# EasyEDA Pro project Cerberus_Power_V02.eprj, board PCB1
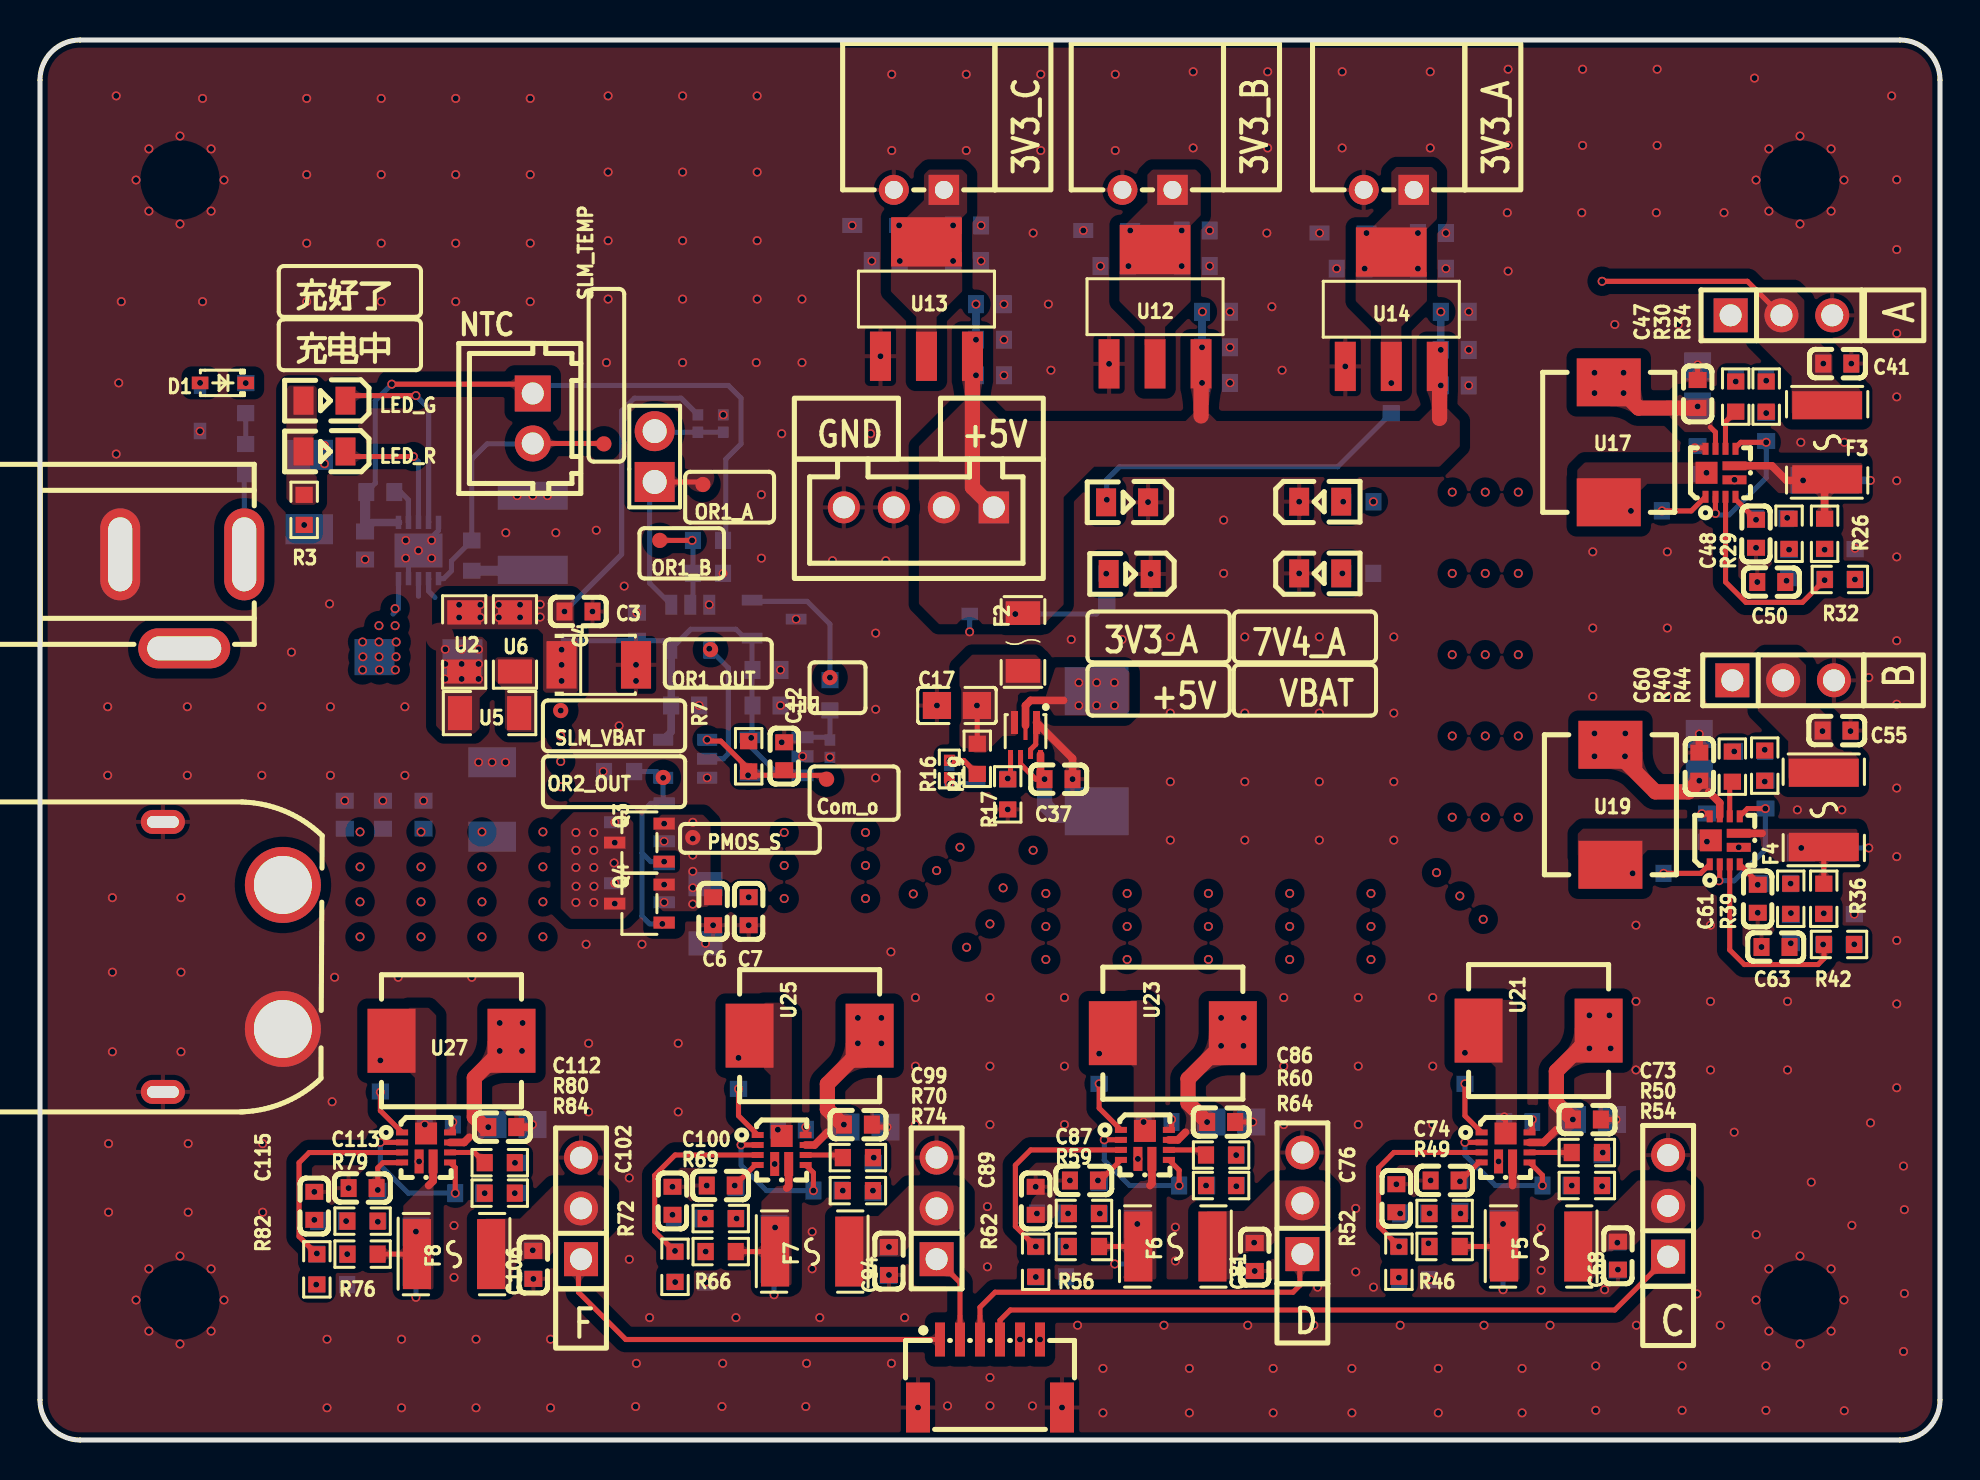
[diagram p2: board, top side]
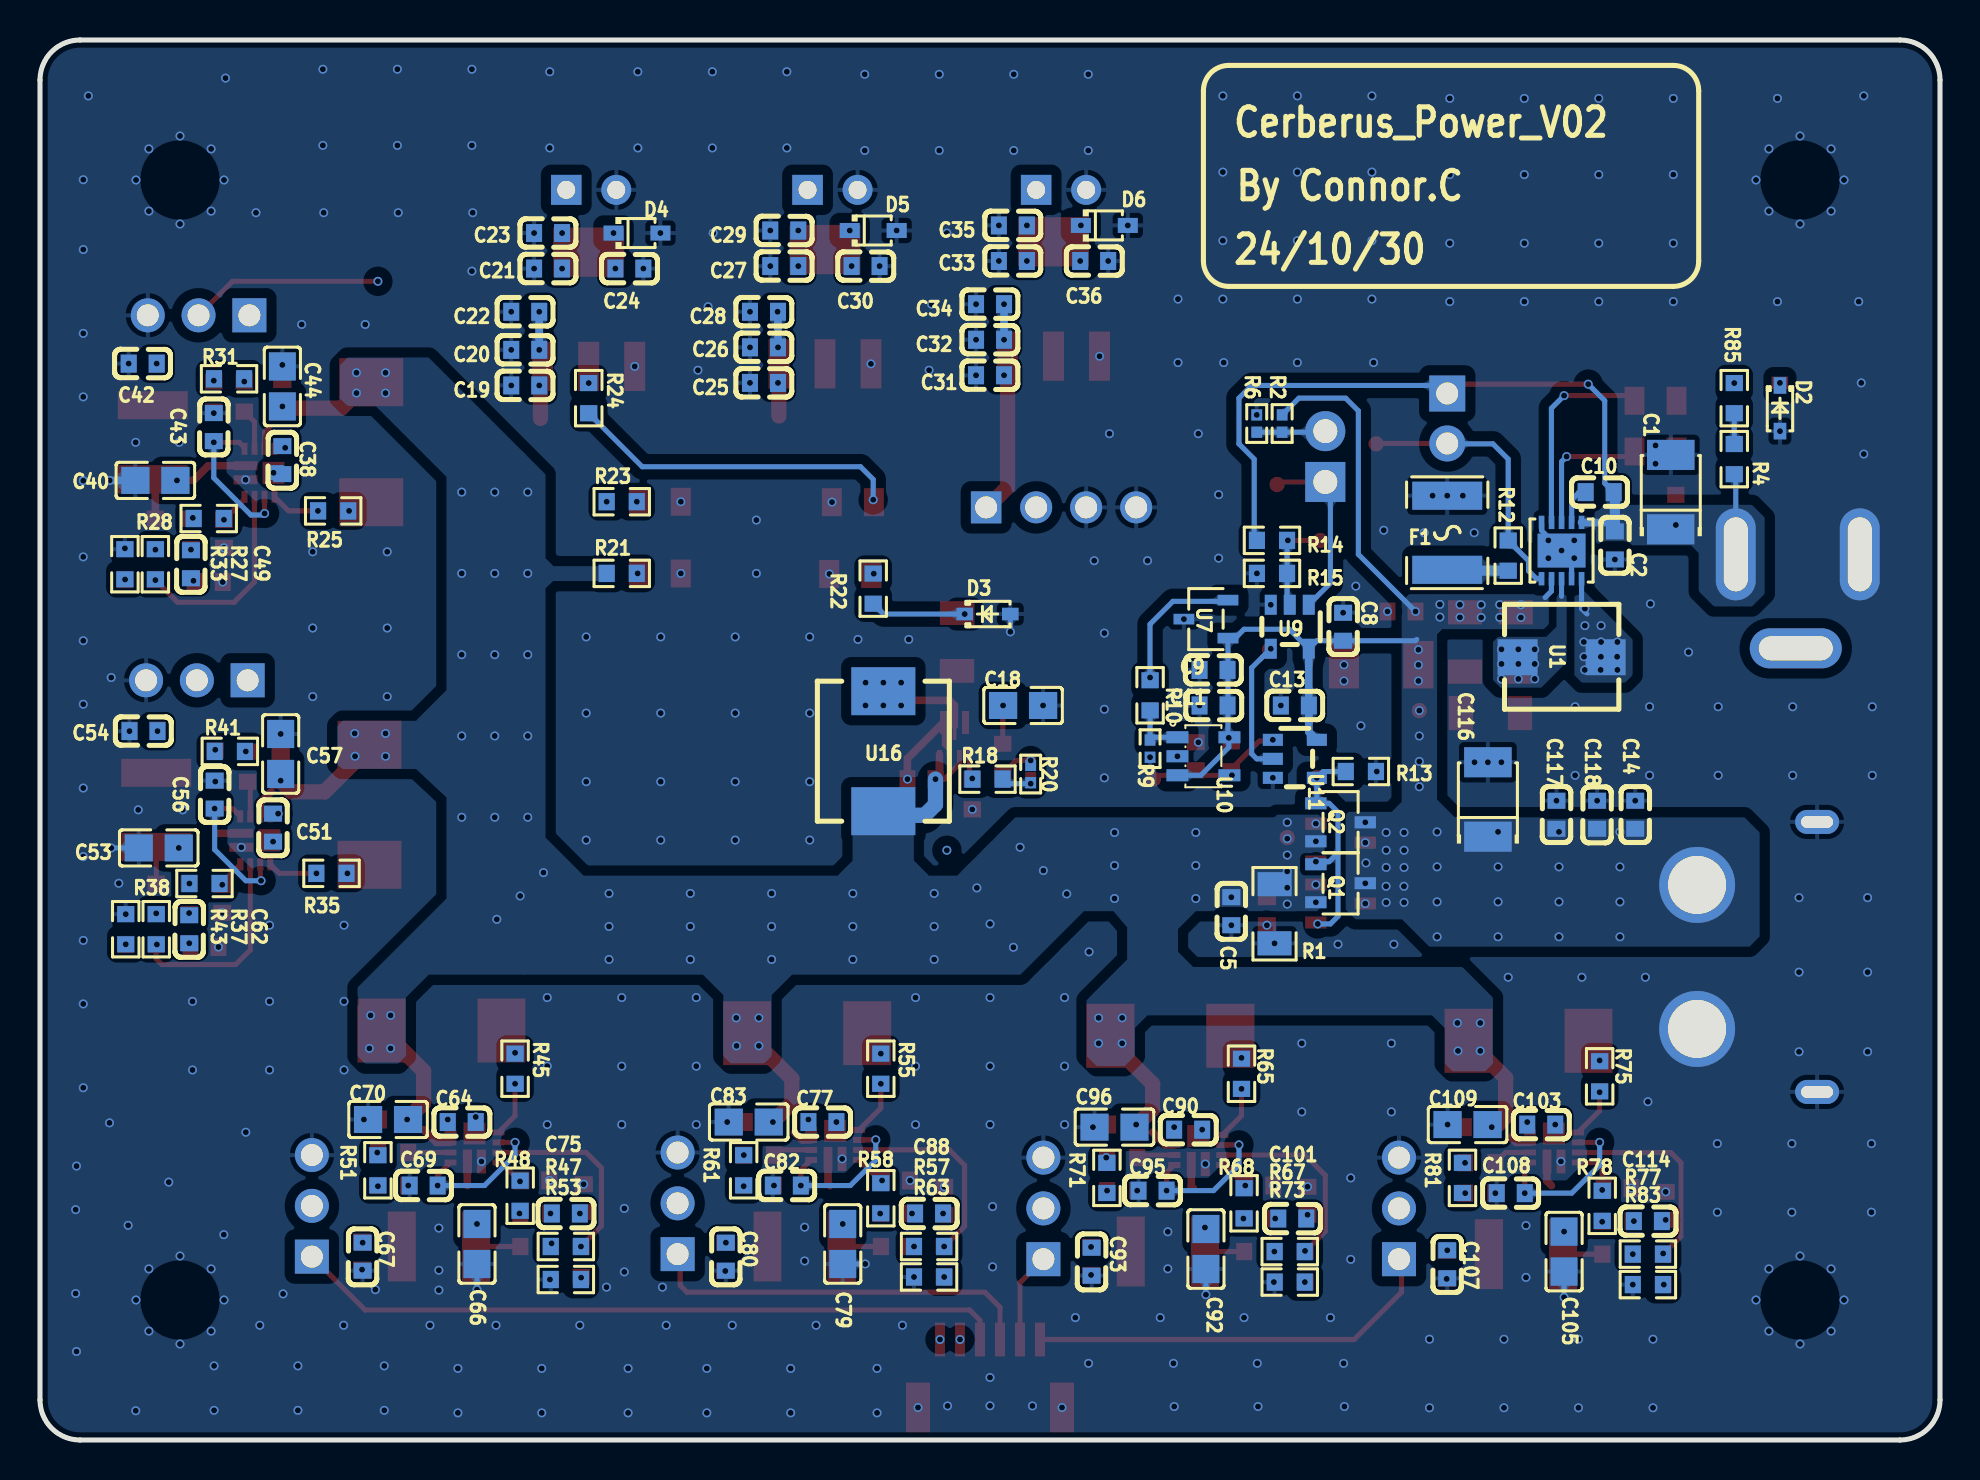
[diagram p3: board, bottom side, seen from below]

Outline 95 x 70 mm; copper layers: Top Layer, GND, 电源加厚, Bottom Layer. Coordinates in mm from the lower left corner of the outline.
Outline path: 0,68 0,2 arc(0.59,0.59) 2,0 93,0 arc(94.41,0.59) 95,2 95,68 arc(94.41,69.41) 93,70 2,70 arc(0.59,69.41) 0,68
Stack: Top Layer 0.035mm 外层铜厚1oz / Dielectric1 0.2104mm 7628 RC49% 8.6mil / GND 0.0152mm 内层铜厚 / Dielectric2 1.065mm 1.1mm H/HOZ Copper / 电源加厚 0.0152mm 内层铜厚 / Dielectric3 0.2104mm 7628 RC49% 8.6mil / Bottom Layer 0.035mm 外层铜厚1oz

## Design rules (mm)
template: 自定义配置
spacing copperThickness1oz (default): track to track 0.102, other pairs 0.152 to 0.3
spacing copperThickness2oz: track to track 0.203, other pairs 0.152 to 0.3
track width copperThickness1oz (default): min 0.127, default 0.254, max 10
track width copperThickness2oz: min 0.203, default 0.254, max 2.54
differential pair differentialPair (default): width min 0.127, default 0.254, max 2.54; gap min 0.152, default 0.152
via viaSize (default): diameter min 0.45, default 0.45, max 0.45; hole min 0.3, default 0.3, max 0.3
net VBAT+ uses 全铺
net V_BC+ uses 全铺
net VCC_BAT uses 全铺
net $3N1102 uses 全铺
net $3N1098 uses 全铺
net $3N1106 uses 全铺
net VCC_7V4_A uses 全铺
net $3N2153 uses 全铺
net $3N2156 uses 全铺
net VCC_7V4_B uses 全铺
net $3N3209 uses 全铺
net $3N3212 uses 全铺
net VCC_7V4_C uses 全铺
net $3N4265 uses 全铺
net $3N4268 uses 全铺
net VCC_7V4_D uses 全铺
net $3N5321 uses 全铺
net $3N5324 uses 全铺
net VCC_7V4_E uses 全铺
net $3N6377 uses 全铺
net $3N6380 uses 全铺
net VCC_7V4_F uses 全铺
net $1N10479 uses 全铺
net $1N10912 uses 全铺
net $1N9964 uses 全铺
net $1N9790 uses 全铺
net $1N9922 uses 全铺
net $1N32600 uses 全铺
net VCC_5V uses 全铺
net VCC_3V3_A uses 全铺
net VCC_3V3_B uses 全铺
net VCC_3V3_C uses 全铺
net $1N30083 uses 全铺

## Placement (name value [footprint] x y rotation side)
C1  22uF  [CASE-B_3528]  13.46 47.39 90 bottom
C2  100nF  [C0603]  16.26 44.73 270 bottom
C3  100nF  [C0603]  26.92 41.42 0 top
C4  22uF  [CASE-B_3528]  27.94 38.76 0 top
C5  100nF  [C0603]  35.43 26.44 90 bottom
C6  10uF  [C0603]  33.66 26.44 90 top
C7  22uF  [C0603]  35.43 26.44 90 top
C8  100nF  [C0603]  29.84 40.66 270 bottom
C9  100nF  [C0603]  36.32 38.5 180 bottom
C10  100nF  [C0603]  17.02 47.39 180 bottom
C11  100nF  [C0603]  36.32 36.73 0 bottom
C12  15pF  [C0603]  37.21 34.19 270 top
C13  100nF  [C0603]  32.26 36.73 180 bottom
C14  NC  [C0603]  15.24 31.27 270 bottom
C17  47uF  [C0805]  45.85 36.73 0 top
C18  47uF  [C0805]  45.85 36.73 0 bottom
C19  2.2uF  [C0603]  70.74 52.73 180 bottom
C20  100nF  [C0603]  70.74 54.51 180 bottom
C21  100nF  [C0603]  69.6 58.57 180 bottom
C22  NC  [C0603]  70.74 56.41 180 bottom
C23  2.2uF  [C0603]  69.6 60.35 180 bottom
C24  NC  [C0603]  65.53 58.57 0 bottom
C25  2.2uF  [C0603]  58.8 52.86 180 bottom
C26  100nF  [C0603]  58.8 54.63 180 bottom
C27  100nF  [C0603]  57.78 58.7 180 bottom
C28  NC  [C0603]  58.8 56.41 180 bottom
C29  2.2uF  [C0603]  57.78 60.47 180 bottom
C30  NC  [C0603]  53.72 58.7 0 bottom
C31  2.2uF  [C0603]  47.5 53.24 180 bottom
C32  100nF  [C0603]  47.5 55.01 180 bottom
C33  100nF  [C0603]  46.35 58.95 180 bottom
C34  NC  [C0603]  47.5 56.79 180 bottom
C35  2.2uF  [C0603]  46.35 60.73 180 bottom
C36  NC  [C0603]  42.29 58.95 0 bottom
C37  10uF  [C0603]  50.93 33.04 180 top
C38  100nF  [C0603]  82.88 49 90 bottom
C40  47uF  [C0805]  89.23 47.98 180 bottom
C41  1uF  [C0603]  89.87 53.82 180 top
C42  100nF  [C0603]  89.87 53.82 180 bottom
C43  10uF  [C0603]  86.31 50.65 270 bottom
C44  47uF  [C0805]  82.88 52.68 270 bottom
C47  100nF  [C0603]  82.88 52.3 270 top
C48  39pF  [C0603]  85.8 45.31 90 top
C49  1nF  [C0603]  87.45 43.79 90 bottom
C50  4.7nF  [C0603]  86.56 42.9 180 top
C51  100nF  [C0603]  83.35 30.62 90 bottom
C53  47uF  [C0805]  89.06 29.6 180 bottom
C54  1uF  [C0603]  89.82 35.44 180 bottom
C55  100nF  [C0603]  89.83 35.47 180 top
C56  10uF  [C0603]  86.27 32.27 270 bottom
C57  47uF  [C0805]  82.97 34.3 270 bottom
C60  100nF  [C0603]  82.97 33.67 270 top
C61  39pF  [C0603]  85.89 27.06 90 top
C62  1nF  [C0603]  87.54 25.54 90 bottom
C63  4.7nF  [C0603]  86.78 24.65 180 top
C64  100nF  [C0603]  73.91 15.9 0 bottom
C66  47uF  [C0805]  73.15 9.8 90 bottom
C67  1uF  [C0603]  78.87 9.17 90 bottom
C68  100nF  [C0603]  78.9 9.22 90 top
C69  10uF  [C0603]  75.82 12.72 180 bottom
C70  47uF  [C0805]  77.6 16.03 180 bottom
C73  100nF  [C0603]  77.34 16.03 180 top
C74  39pF  [C0603]  70.23 12.98 0 top
C75  1nF  [C0603]  68.71 11.33 0 bottom
C76  4.7nF  [C0603]  67.82 12.09 90 top
C77  100nF  [C0603]  55.88 15.9 0 bottom
C79  47uF  [C0805]  54.86 9.8 90 bottom
C80  1uF  [C0603]  60.71 9.17 90 bottom
C81  100nF  [C0603]  60.74 9.15 90 top
C82  10uF  [C0603]  57.66 12.72 180 bottom
C83  47uF  [C0805]  59.56 15.9 180 bottom
C86  100nF  [C0603]  59.06 15.9 180 top
C87  39pF  [C0603]  52.2 12.98 0 top
C88  1nF  [C0603]  50.55 11.33 0 bottom
C89  4.7nF  [C0603]  49.78 11.96 90 top
C90  100nF  [C0603]  37.59 15.52 0 bottom
C92  47uF  [C0805]  36.7 9.55 90 bottom
C93  1uF  [C0603]  42.42 8.91 90 bottom
C94  100nF  [C0603]  42.45 8.95 90 top
C95  10uF  [C0603]  39.37 12.47 180 bottom
C96  47uF  [C0805]  41.28 15.64 180 bottom
C99  100nF  [C0603]  40.89 15.77 180 top
C100  39pF  [C0603]  34.04 12.72 0 top
C101  1nF  [C0603]  32.38 11.07 0 bottom
C102  4.7nF  [C0603]  31.62 11.96 90 top
C103  100nF  [C0603]  19.94 15.77 0 bottom
C105  47uF  [C0805]  18.8 9.42 90 bottom
C106  1uF  [C0603]  24.67 8.75 90 top
C107  100nF  [C0603]  24.64 8.79 90 bottom
C108  10uF  [C0603]  21.46 12.34 180 bottom
C109  47uF  [C0805]  23.62 15.77 180 bottom
C112  100nF  [C0603]  23.11 15.64 180 top
C113  39pF  [C0603]  16.13 12.6 0 top
C114  1nF  [C0603]  14.61 10.94 0 bottom
C115  4.7nF  [C0603]  13.72 11.71 90 top
C116  22uF  [CASE-B_3528]  22.61 32.03 90 bottom
C117  10uF  [C0603]  19.18 31.27 270 bottom
C118  100nF  [C0603]  17.14 31.27 90 bottom
CN5  XT60PW-M  [CONN-TH_XT60PW-M]  9.14 24.15 0 top
CN6  WAFER-SH1.0-6PWB  [CONN-SMD_6P-P1.00_XUNPU_WAFER-SH1.0-6PWB]  47.5 3.32 0 top
CN7  ZX-XH2.54-2PWZ  [CONN-TH_2P-P2.50_ZX-XH2.54-2PWZ]  67.44 62.51 180 top
CN8  ZX-XH2.54-2PWZ  [CONN-TH_2P-P2.50_ZX-XH2.54-2PWZ]  55.37 62.51 180 top
CN9  ZX-XH2.54-2PWZ  [CONN-TH_2P-P2.50_ZX-XH2.54-2PWZ]  43.94 62.51 180 top
CN10  ZX-XH2.54-4PZZ  [CONN-TH_4P-P2.50_4PIN]  43.94 46.63 180 top
Com_o  -  [Test-Point-0.5mm]  39.33 33.04 90 top
D  PZ254V-11-03P  [HDR-TH_3P-P2.54-V-M]  63.12 11.83 90 top
D1  BZT52B5V1S  [sod-323_l1.7-w1.3-ls2.6-rd]  9.14 52.86 180 top
D2  BZT52C3V3S  [sod-323_l1.7-w1.3-ls2.6-rd]  8 51.58 270 bottom
D3  BZT52B5V1S  [sod-323_l1.7-w1.3-ls2.6-rd]  47.62 41.3 180 bottom
D4  BZT52C3V3S  [SOD-323_L1.8-W1.3-LS2.5-RD]  65.15 60.35 180 bottom
D5  BZT52C3V3S  [SOD-323_L1.8-W1.3-LS2.5-RD]  53.34 60.47 180 bottom
D6  BZT52C3V3S  [SOD-323_L1.8-W1.3-LS2.5-RD]  41.78 60.73 180 bottom
DC2  DC005  [DC-IN-TH_DC005]  7.11 41.93 0 top
F1  BSMD1812-150-24V  [F1812]  24.64 45.36 90 bottom
F2  JFC1206-1300FS  [F1206]  49.15 39.9 90 top
F3  mSMD110-33V  [F1812]  89.36 49.88 90 top
F4  mSMD110-33V  [F1812]  89.19 31.51 90 top
F5  mSMD110-33V  [F1812]  75.06 9.68 0 top
F6  mSMD110-33V  [F1812]  56.77 9.68 0 top
F7  mSMD110-33V  [F1812]  38.61 9.42 0 top
F8  mSMD110-33V  [F1812]  20.7 9.29 0 top
H1  PZ254V-11-02P  [HDR-TH_2P-P2.54-V-M]  30.73 49.17 90 top
H2  PZ254V-11-03P  [HDR-TH_3P-P2.54-V-M]  87.07 56.23 0 top
H3  PZ254V-11-03P  [HDR-TH_3P-P2.54-V-M]  87.16 37.98 0 top
H4  PZ254V-11-03P  [HDR-TH_3P-P2.54-V-M]  81.41 11.71 90 top
H6  PZ254V-11-03P  [HDR-TH_3P-P2.54-V-M]  44.83 11.58 90 top
H7  PZ254V-11-03P  [HDR-TH_3P-P2.54-V-M]  27.05 11.58 90 top
LED1  NCD0805R1  [LED0805-R-RD]  64.01 43.33 0 top
LED2  NCD0805R1  [LED0805-R-RD]  54.48 43.3 180 top
LED3  NCD0805R1  [LED0805-R-RD]  64.01 46.91 0 top
LED4  NCD0805R1  [LED0805-R-RD]  54.36 46.89 180 top
LED_G  NCD0805R1  [LED0805-R-RD]  14.22 51.97 180 top
LED_R  NCD0805R1  [LED0805-R-RD]  14.22 49.43 180 top
NTC  ZX-XH2.54-2PZZ  [CONN-TH_2P-P2.50_HX25003-2A]  24.64 51.08 270 top
OR1_A  -  [Test-Point-0.5mm]  33.15 47.78 90 top
OR1_B  -  [Test-Point-0.5mm]  30.99 44.98 180 top
OR1_OUT  -  [Test-Point-0.5mm]  33.53 39.52 0 top
OR2_OUT  -  [Test-Point-0.5mm]  31.16 33.13 180 top
PMOS_S  -  [Test-Point-0.5mm]  32.64 30.12 0 top
Q1  SI2305  [SOT-23-3_L2.9-W1.6-P1.90-LS2.8-BR]  29.97 27.84 0 bottom
Q2  SI2305  [SOT-23-3_L2.9-W1.6-P1.90-LS2.8-BR]  29.97 30.88 0 bottom
Q3  SI2305  [SOT-23-3_L2.9-W1.6-P1.90-LS2.8-BR]  29.97 29.87 0 top
Q4  SI2305  [SOT-23-3_L2.9-W1.6-P1.90-LS2.8-BR]  29.97 26.82 0 top
R1  100kΩ  [R1206]  33.27 26.31 90 bottom
R2  10kΩ  [R0402]  32.89 50.82 90 bottom
R3  1kΩ  [R0603]  13.21 46.5 90 top
R4  200kΩ  [R0603]  10.29 49.05 270 bottom
R6  1MΩ  [R0402]  34.16 50.82 270 bottom
R7  4.7kΩ  [R0603]  35.43 34.19 90 top
R9  10kΩ  [R0402]  39.5 34.57 270 bottom
R10  0Ω  [R0603]  39.5 37.23 90 bottom
R12  470Ω  [R0603]  21.59 44.22 270 bottom
R13  1MΩ  [R0603]  28.96 33.42 180 bottom
R14  200kΩ  [R0603]  33.4 44.98 0 bottom
R15  200kΩ  [R0603]  33.4 43.33 180 bottom
R16  1MΩ  [R0402]  45.47 33.55 270 top
R17  100kΩ  [R0603]  48.39 32.28 90 top
R18  200kΩ  [R0603]  47.62 33.04 0 bottom
R19  33kΩ  [R0603]  46.86 34.06 270 top
R20  1MΩ  [R0402]  45.47 33.3 270 bottom
R21  1kΩ  [R0603]  65.91 43.33 180 bottom
R22  1kΩ  [R0603]  53.34 42.57 90 bottom
R23  1kΩ  [R0603]  65.91 46.91 180 bottom
R24  1kΩ  [R0603]  67.56 52.09 270 bottom
R25  300kΩ  [R0603]  80.34 46.45 0 bottom
R26  300kΩ  [R0603]  89.23 45.31 270 top
R27  33kΩ  [R0603]  89.23 43.79 90 bottom
R28  33kΩ  [R0603]  86.56 46.07 180 bottom
R29  3kΩ  [R0603]  87.45 45.31 90 top
R30  100kΩ  [R0603]  84.79 52.17 270 top
R31  20kΩ  [R0603]  85.55 53.06 180 bottom
R32  33kΩ  [R0603]  89.99 43.03 180 top
R33  33kΩ  [R0603]  90.75 43.79 270 bottom
R34  4.7kΩ  [R0603]  86.31 52.17 90 top
R35  300kΩ  [R0603]  80.43 28.33 0 bottom
R36  300kΩ  [R0603]  89.19 27.06 270 top
R37  33kΩ  [R0603]  89.19 25.54 90 bottom
R38  33kΩ  [R0603]  86.78 27.82 180 bottom
R39  3kΩ  [R0603]  87.54 27.06 90 top
R40  100kΩ  [R0603]  84.62 33.67 270 top
R41  20kΩ  [R0603]  85.51 34.43 180 bottom
R42  33kΩ  [R0603]  89.95 24.78 180 top
R43  33kΩ  [R0603]  90.71 25.54 270 bottom
R44  4.7kΩ  [R0603]  86.24 33.72 90 top
R45  300kΩ  [R0603]  71.25 18.56 270 bottom
R46  300kΩ  [R0603]  70.23 9.68 180 top
R47  33kΩ  [R0603]  68.71 9.68 0 bottom
R48  33kΩ  [R0603]  70.99 12.22 90 bottom
R49  3kΩ  [R0603]  70.23 11.33 0 top
R50  100kΩ  [R0603]  77.34 14.37 180 top
R51  20kΩ  [R0603]  78.1 13.48 90 bottom
R52  33kΩ  [R0603]  67.94 8.91 90 top
R53  33kΩ  [R0603]  68.71 8.02 180 bottom
R54  4.7kΩ  [R0603]  77.34 12.72 0 top
R55  300kΩ  [R0603]  52.96 18.56 270 bottom
R56  300kΩ  [R0603]  52.2 9.68 180 top
R57  33kΩ  [R0603]  50.55 9.68 0 bottom
R58  33kΩ  [R0603]  52.96 12.09 90 bottom
R59  3kΩ  [R0603]  52.2 11.33 0 top
R60  100kΩ  [R0603]  59.06 14.25 180 top
R61  20kΩ  [R0603]  59.82 13.48 90 bottom
R62  33kΩ  [R0603]  49.78 8.91 90 top
R63  33kΩ  [R0603]  50.55 8.15 180 bottom
R64  4.7kΩ  [R0603]  59.06 12.72 0 top
R65  300kΩ  [R0603]  34.93 18.31 270 bottom
R66  300kΩ  [R0603]  34.04 9.42 180 top
R67  33kΩ  [R0603]  32.51 9.42 0 bottom
R68  33kΩ  [R0603]  34.8 11.83 90 bottom
R69  3kΩ  [R0603]  34.04 11.07 0 top
R70  100kΩ  [R0603]  40.89 14.12 180 top
R71  20kΩ  [R0603]  41.66 13.1 90 bottom
R72  33kΩ  [R0603]  31.75 8.66 90 top
R73  33kΩ  [R0603]  32.51 7.9 180 bottom
R74  4.7kΩ  [R0603]  40.89 12.47 0 top
R75  300kΩ  [R0603]  17.02 18.18 270 bottom
R76  300kΩ  [R0603]  16.13 9.29 180 top
R77  33kΩ  [R0603]  14.61 9.29 0 bottom
R78  33kΩ  [R0603]  16.89 11.71 90 bottom
R79  3kΩ  [R0603]  16.13 10.94 0 top
R80  100kΩ  [R0603]  22.99 13.87 180 top
R81  20kΩ  [R0603]  23.88 13.1 90 bottom
R82  33kΩ  [R0603]  13.84 8.53 90 top
R83  33kΩ  [R0603]  14.61 7.77 180 bottom
R84  4.7kΩ  [R0603]  22.99 12.34 0 top
R85  300kΩ  [R0603]  10.29 52.09 270 bottom
REF  -  [Test-Point-0.5mm#2]  39.5 38.12 0 bottom
SLM_TEMP  -  [Test-Point-0.5mm]  28.19 49.81 90 top
SLM_VBAT  -  [Test-Point-0.5mm]  26.03 36.47 0 top
U1  6.8uH  [IND-SMD_L5.7-W5.2]  18.92 39.14 0 bottom
U2  50mΩ  [R1206]  21.21 39.9 90 top
U4  SLM6305  [TDFN-10_L3.0-W3.0-P0.50-BL-EP]  18.92 44.47 0 bottom
U5  50mΩ  [R1206]  22.48 36.34 0 top
U6  50mΩ  [R1206]  23.75 39.9 90 top
U7  3V3基准  [SOT-23-3_L3.0-W1.7-P0.95-LS2.9-BR]  36.7 41.04 180 bottom
U9  或门  [SOT-23-5_L2.9-W1.6-P0.95-LS2.8-BR]  32.51 40.66 90 bottom
U10  比较器  [SOT-23-5_L3.0-W1.7-P0.95-LS2.8-BR]  36.83 34.19 0 bottom
U11  或门  [SOT-23-5_L2.9-W1.6-P0.95-LS2.8-BR]  32.26 34.06 0 bottom
U12  LM1117IMPX-3.3/NOPB  [SOT-223_L6.5-W3.5-P2.30-LS7.0-BR]  55.75 56.67 270 top
U13  LM1117IMPX-3.3/NOPB  [SOT-223_L6.5-W3.5-P2.30-LS7.0-BR]  44.32 57.05 270 top
U14  LM1117IMPX-3.3/NOPB  [SOT-223_L6.5-W3.5-P2.30-LS7.0-BR]  67.56 56.54 270 top
U15  TPS61022RWUR  [VQFN-7_L2.0-W2.0-P0.55-TL_RWU]  49.28 35.08 270 top
U16  1uH  [IND-SMD_L7.0-W6.6]  52.83 34.44 270 bottom
U17  1uH  [IND-SMD_L7.0-W6.6]  78.44 49.88 270 top
U18  TPS61089RNRR  [VQFN-HR_L2.5-W2.0-P0.50-TL-EP]  84.02 48.36 90 top
U19  1uH  [IND-SMD_L7.0-W6.6]  78.52 31.76 270 top
U20  TPS61089RNRR  [VQFN-HR_L2.5-W2.0-P0.50-TL-EP]  84.24 29.98 90 top
U21  1uH  [IND-SMD_L7.0-W6.6]  74.93 20.47 180 top
U22  TPS61089RNRR  [VQFN-HR_L2.5-W2.0-P0.50-TL-EP]  73.28 14.63 0 top
U23  1uH  [IND-SMD_L7.0-W6.6]  56.64 20.34 180 top
U24  TPS61089RNRR  [VQFN-HR_L2.5-W2.0-P0.50-TL-EP]  55.25 14.75 0 top
U25  1uH  [IND-SMD_L7.0-W6.6]  38.48 20.22 180 top
U26  TPS61089RNRR  [VQFN-HR_L2.5-W2.0-P0.50-TL-EP]  37.08 14.5 0 top
U27  1uH  [IND-SMD_L7.0-W6.6]  20.57 19.96 180 top
U28  TPS61089RNRR  [VQFN-HR_L2.5-W2.0-P0.50-TL-EP]  19.3 14.63 0 top

## Footprints (pads in the part's own frame, mm; a bottom-side part is the same pattern mirrored in y, then rotated)
C0603
  rect 0.8x0.9 smd: 1(-0.7,0) 2(0.7,0)
C0805
  rect 1.41x1.35 smd: 1(-1,0) 2(1,0)
CASE-B_3528
  rect 1.506x2.376 smd: 1(-1.861,0) 2(1.861,0)
CONN-SMD_6P-P1.00_XUNPU_WAFER-SH1.0-6PWB
  rect 0.5x1.7 smd: 1(-2.5,1.7) 2(-1.5,1.7) 3(-0.5,1.7) 4(0.5,1.7) 5(1.5,1.7) 6(2.5,1.7)
  rect 1.2x2.5 smd: 7(3.6,-1.7) 8(-3.6,-1.7)
CONN-TH_2P-P2.50_HX25003-2A
  rect 1.8x1.8 hole 1.1: 1(-1.25,0)
  round 1.8 hole 1.1: 2(1.25,0)
CONN-TH_2P-P2.50_ZX-XH2.54-2PWZ
  rect 1.524x1.5 hole 0.9: 1(-1.25,0)
  round 1.5 hole 0.9: 2(1.25,0)
CONN-TH_4P-P2.50_4PIN
  rect 1.524x1.6 hole 1.1: 1(-3.75,0)
  round 1.6 hole 1.1: 2(-1.25,0) 3(1.25,0) 4(3.75,0)
CONN-TH_XT60PW-M
  round 3.8 hole 2.9: 1(3,-3.6) 2(3,3.6)
  oval 2.2x1.2 hole 1.6x0.6: 3(-3,6.75) 4(-3,-6.75)
DC-IN-TH_DC005
  oval 2x4.6 hole 1.2x3.7: 1(3.1,2.35) 2(-3.1,2.35)
  oval 4.6x2 hole 3.7x1.2: 3(0.1,-2.35)
F1206
  rect 1.19x1.728 smd: 1(-1.445,0) 2(1.445,0)
F1812
  rect 1.407x3.499 smd: 1(-1.853,0) 2(1.853,0)
HDR-TH_2P-P2.54-V-M
  rect 2x2 hole 1.2: 1(-1.27,0)
  round 2 hole 1.2: 2(1.27,0)
HDR-TH_3P-P2.54-V-M
  rect 1.7x1.7 hole 1.1: 1(-2.54,0)
  round 1.7 hole 1.1: 2(0,0) 3(2.54,0)
IND-SMD_L5.7-W5.2
  rect 2x1.8 smd: 1(-2.2,0) 2(2.2,0)
IND-SMD_L7.0-W6.6
  rect 2.4x3.2 smd: 1(-3,0) 2(3,0)
LED0805-R-RD
  rect 1x1.399 smd: 1(1.05,0) 2(-1.05,0)
R0402
  rect 0.566x0.54 smd: 1(-0.433,0) 2(0.433,0)
R0603
  rect 0.806x0.864 smd: 1(-0.753,0) 2(0.753,0)
R1206
  rect 1.208x1.701 smd: 1(-1.479,0) 2(1.479,0)
sod-323_l1.7-w1.3-ls2.6-rd
  rect 0.83x0.63 smd: 1(-1.14,0) 2(1.14,0)
SOD-323_L1.8-W1.3-LS2.5-RD
  rect 1x0.75 smd: 1(-1.173,0) 2(1.173,0)
SOT-23-3_L2.9-W1.6-P1.90-LS2.8-BR
  rect 1.07x0.6 smd: 1(1.235,-0.95) 2(1.235,0.95) 3(-1.235,0)
SOT-23-3_L3.0-W1.7-P0.95-LS2.9-BR
  rect 1.038x0.532 smd: 1(1.101,-0.95) 2(1.101,0.95) 3(-1.101,0)
SOT-23-5_L2.9-W1.6-P0.95-LS2.8-BR
  rect 1x0.6 smd: 1(1.1,-0.95) 2(1.1,0) 3(1.1,0.95) 4(-1.1,0.95) 5(-1.1,-0.95)
SOT-23-5_L3.0-W1.7-P0.95-LS2.8-BR
  rect 1.1x0.6 smd: 1(1.3,-0.95) 2(1.3,0) 3(1.3,0.95) 4(-1.3,0.95) 5(-1.3,-0.95)
SOT-223_L6.5-W3.5-P2.30-LS7.0-BR
  rect 2.465x1.05 smd: 1(2.857,-2.3) 2(2.857,0) 3(2.857,2.3)
  rect 2.465x3.54 smd: 4(-2.857,0)
TDFN-10_L3.0-W3.0-P0.50-BL-EP
  rect 0.28x0.665 smd: 1(-1,-1.407) 2(-0.5,-1.407) 3(0,-1.407) 4(0.5,-1.407) 5(1,-1.407) 6(1,1.407) 7(0.5,1.407) 8(0,1.407) 9(-0.5,1.407) 10(-1,1.407)
  rect 2.4x1.7 smd: 11(0,0)
Test-Point-0.5mm
  round 0.762 smd: 1(0,0)
Test-Point-0.5mm#2
  round 0.762 smd far side: 1(0,0)
VQFN-7_L2.0-W2.0-P0.55-TL_RWU
  rect 1.15x0.35 smd: 1(-0.8,0.55) 3(-0.8,-0.55)
  rect 1.45x0.2 smd: 2(-0.65,0)
  rect 0.45x0.25 smd: 4(0.8,-0.75) 5(0.8,-0.25) 6(0.8,0.25) 7(0.8,0.75)
VQFN-HR_L2.5-W2.0-P0.50-TL-EP
  rect 0.6x0.3 smd: 1(-1.199,0.75) 2(-1.199,0.25) 3(-1.199,-0.25) 4(-1.199,-0.75) 7(1.199,-0.75) 8(1.199,-0.25) 9(1.199,0.25) 10(1.199,0.75)
  rect 0.45x1.2 smd: 5(-0.35,-0.7) 6(0.35,-0.7)
  rect 1.1x1.1 smd: 11(0,0.7)

## Nets
As in the schematic, except:
GND: C1.2 C2.2 C3.2 C4.2 C5.1 C6.1 C7.1 C8.1 C9.1 C11.2 C12.1 C13.1 C14.1 C17.1 C18.1 C19.1 C20.1 C21.1 C22.1 C23.1 C24.1 C25.1 C26.1 C27.1 C28.1 C29.1 C30.1 C31.1 C32.1 C33.1 C34.1 C35.1 C36.1 C37.1 C40.1 C41.1 C42.1 C43.1 C44.1 C47.1 C48.1 C50.2 C53.1 C54.1 C55.1 C56.1 C57.1 C60.1 C61.1 C63.2 C66.1 C67.1 C68.1 C69.1 C70.1 C73.1 C74.1 C76.2 C79.1 C80.1 C81.1 C82.1 C83.1 C86.1 C87.1 C89.2 C92.1 C93.1 C94.1 C95.1 C96.1 C99.1 C100.1 C102.2 C105.1 C106.1 C107.1 C108.1 C109.1 C112.1 C113.1 C115.2 C116.2 C117.1 C118.2 CN5.1 CN5.3 CN5.4 CN6.7 CN6.8 CN7.2 CN8.2 CN9.2 CN10.3 CN10.4 D.3 D2.2 D3.2 D4.2 D5.2 D6.2 DC2.2 F1.2 H2.3 H3.3 H4.3 H6.3 H7.3 LED1.2 LED2.2 LED3.2 LED4.2 R1.1 R6.1 R9.2 R13.2 R15.1 R17.1 R33.1 R34.1 R43.1 R44.1 R53.1 R54.1 R63.1 R64.1 R73.1 R74.1 R83.1 R84.1 U4.5 U4.9 U4.11 U7.3 U9.3 U10.2 U11.3 U12.1 U13.1 U14.1 U15.1 U15.6 U18.5 U20.5 U22.5 U24.5 U26.5 U28.5
VCC_7V4_D: C80.2 C81.2 D.2 F6.2
SERVO_PWM_D: CN6.3 D.1
V_BC+: C1.1 C2.1 C10.2 DC2.1 NTC.1 R3.1 R4.2 R14.2 U4.1
$1N10230: NTC.2 R12.1 SLM_TEMP.1 U4.6
$1N15514: H1.1 OR1_A.1 U9.1
$1N17856: C12.2 Com_o.1 R7.1 U10.4 U11.1

## Via types
v1: diameter 0.45, hole 0.299, Top Layer to Bottom Layer, 278 vias
v2: diameter 0.45, hole 0.3, Top Layer to Bottom Layer, 464 vias

## Routing (per net, layer and track width the routed paths; a pad name or vN(x,y) marks a point on that pad's centre or on a via; arc(x,y) is an arc through that point)
GND: length 22.1
  Top Layer w0.254: C47.1 82.88,53.75 v2(82.88,53.76) ; v2(78.81,16.03) 78.04,16.03 ; C86.1 v2(60.64,15.9) ; C99.1 41.72,15.64 v2(42.35,15.64) ; 49.79,35.71 49.79,34.78 49.53,34.52 U15.6
  Top Layer w0.381: U15.1 51.63,34.07 v2(51.63,33.04) ; C112.1 24.5,15.64 v2(24.62,15.77) ; C60.1 v2(82.97,35.3)
  Bottom Layer w0.254: C105.1 v2(18.8,7.13) ; C79.1 v2(53.74,8.8) 53.72,8.79 ; v2(46.48,40.41) 46.49,40.41 D3.2 ; U4.5 19.92,45.47 v2(18.92,44.47) 18.42,43.97 U4.9 ; C53.1 v2(91.44,29.6) ; v2(36.7,7.26) C92.1 ; C66.1 v2(73.15,7.52)
  Bottom Layer w0.381: C40.1 v2(91.52,47.98)
  vias: v1(3.39,36.66) v1(3.39,33.23) v1(3.43,14.82) v1(3.43,11.39) v1(3.62,27.12) v1(3.62,23.39) v1(3.62,19.41) v1(3.81,67.21) v1(3.81,49.3) v1(3.94,52.86) v1(4.06,56.92) v1(7.05,27.12) v1(7.05,23.39) v1(7.05,19.41) v1(7.37,36.66) v1(7.37,33.23) v1(7.41,14.82) v1(7.41,11.39) v1(8.13,67.08) v1(8.13,56.92) v1(11.09,36.66) v1(11.09,33.23) v1(11.13,14.82) v1(11.13,11.39) v1(12.57,39.39) v1(13.33,67.08) v1(13.33,63.27) v1(13.33,59.84) v1(13.33,56.92) v1(14.35,5.04) v1(14.35,1.61) v1(14.48,41.81) v1(14.52,36.66) v1(14.52,33.23) v1(14.61,16.91) v1(14.73,23.14) v1(17.06,67.08) v1(17.06,63.27) v1(17.06,59.84) v1(17.06,56.92) v1(17.91,23.14) v1(18.08,5.04) v1(18.08,1.61) v1(18.25,36.66) v1(18.25,33.23) v1(20.7,10.72) v1(20.7,8.13) v1(20.79,67.08) v1(20.79,63.27) v1(20.79,59.84) v1(20.79,56.92) v1(21.59,23.14) v1(21.8,5.04) v1(21.8,1.61) v1(23.29,45.36) v1(24.51,67.08) v1(24.51,63.27) v1(24.51,59.84) v1(24.51,56.92) v1(25.53,5.04) v1(25.53,1.61) v1(25.79,45.36) v1(27.31,24.79) v1(27.43,19.83) v1(27.43,16.41) v1(27.81,45.49) v1(28.32,53.87) v1(28.41,67.21) v1(28.41,63.4) v1(28.41,59.97) v1(28.41,57.05) v1(28.96,35.71) v1(29.21,42.69) v1(29.46,13.1) v1(29.46,9.03) v1(29.82,3.83) v1(29.78,1.67) v1(30.1,24.79) v1(30.48,6.12) v1(31.91,19.83) v1(31.91,16.41) v1(32.13,67.21) v1(32.13,63.4) v1(32.13,59.97) v1(32.13,57.05) v1(32.13,53.87) v1(34.14,3.83) v1(34.1,1.67) v1(34.8,6.12) v1(35.81,53.87) v1(35.86,67.21) v1(35.86,63.4) v1(35.86,59.97) v1(35.86,57.05) v1(36.07,47.27) v1(36.07,44.09) v1(37.08,50.31) v1(38.1,57.05) v1(38.1,53.87) v1(38.33,3.83) v1(38.29,1.67) v1(38.61,10.41) v1(38.61,8.56) v1(38.99,6.12) v1(39.62,43.97) v1(41.53,50.31) v1(41.78,40.35) v1(41.78,36.54) v1(41.78,33.11) v1(42.29,43.97) v1(42.54,24.41) v1(42.59,68.29) v1(42.59,64.48) v1(42.57,3.83) v1(43.23,6.12) v1(43.77,22.12) v1(43.77,18.69) v1(43.77,15.77) v1(45.38,1.7) v1(46.31,68.29) v1(46.31,64.48) v1(47.37,11.67) v1(47.37,8.66) v1(47.5,22.12) v1(47.5,18.69) v1(47.5,15.77) v1(47.5,3.12) v1(47.5,1.71) v1(49.62,1.7) v1(49.66,60.35) v1(50.04,68.29) v1(50.04,64.48) v1(50.42,56.79) v1(50.55,53.49) v1(51.22,22.12) v1(51.22,18.69) v1(51.22,15.77) v1(51.56,40.03) v1(51.88,5.74) v1(53.15,3.58) v1(53.15,1.36) v1(53.76,68.29) v1(53.76,64.48) v1(54.1,40.03) v1(56.2,5.74) v1(56.51,40.16) v1(56.51,36.34) v1(56.51,32.92) v1(56.51,30) v1(56.77,10.64) v1(56.77,8.95) v1(57.47,3.58) v1(57.47,1.36) v1(57.66,68.41) v1(57.66,64.6) v1(59.18,46) v1(59.18,43.33) v1(60.24,40.16) v1(60.24,36.34) v1(60.24,32.92) v1(60.24,30) v1(60.39,5.74) v1(61.34,60.35) v1(61.38,68.41) v1(61.38,64.6) v1(61.59,56.67) v1(61.66,3.58) v1(61.66,1.36) v1(62.1,53.49) v1(62.19,22.12) v1(62.19,18.69) v1(62.19,15.77) v1(63.69,5.74) v1(63.88,7.64) v1(63.97,40.16) v1(63.97,36.34) v1(63.97,32.92) v1(63.97,30) v1(65.11,68.41) v1(65.11,64.6) v1(65.6,3.58) v1(65.6,1.36) v1(65.79,11.58) v1(65.79,8.41) v1(65.91,22.12) v1(65.91,18.69) v1(65.91,15.77) v1(66.68,7.64) v1(67.69,40.16) v1(67.69,36.34) v1(67.69,32.92) v1(67.69,30) v1(68.01,5.74) v1(69.51,68.41) v1(69.51,64.6) v1(69.64,22.12) v1(69.64,18.69) v1(69.64,15.77) v1(69.91,3.58) v1(69.91,1.36) v1(72.2,5.74) v1(73.41,68.54) v1(73.41,64.73) v1(73.36,61.36) v1(73.41,58.44) v1(74.1,3.58) v1(74.1,1.36) v1(75.06,10.6) v1(75.06,8.49) v1(75.06,7.49) v1(75.5,5.74) v1(77.13,68.54) v1(77.13,64.73) v1(77.09,61.36) v1(77.64,44.41) v1(77.64,40.6) v1(77.64,37.17) v1(77.79,3.71) v1(77.79,1.48) v1(78.23,7.52) v1(78.74,55.78) v1(79.8,25.74) v1(79.8,21.93) v1(79.8,18.5) v1(79.82,5.74) v1(80.81,61.36) v1(80.86,68.54) v1(80.86,64.73) v1(81.36,44.41) v1(81.36,40.6) v1(81.36,37.17) v1(81.91,55.78) v1(82.11,3.71) v1(82.11,1.48) v1(82.85,7.3) v1(83.52,25.74) v1(83.52,21.93) v1(83.52,18.5) v1(84.01,5.74) v1(84.2,61.36) v1(84.71,15.39) v1(85.72,68.09) v1(85.81,10.27) v1(86.3,3.71) v1(86.3,1.48) v1(87.38,21.93) v1(87.38,18.5) v1(87.87,31.51) v1(88.04,49.88) v1(88.56,12.89) v1(90.09,31.51) v1(90.22,49.88) v1(90.21,1.46) v1(90.59,10.73) v1(91.06,27.84) v1(91.44,38.12) v1(91.52,15.86) v1(92.58,67.21) v1(92.84,63.02) v1(92.84,59.52) v1(92.84,55.33) v1(92.84,52.16) v1(92.84,47.97) v1(92.84,44.16) v1(92.84,39.96) v1(92.84,36.79) v1(92.84,32.6) v1(92.84,29.17) v1(92.84,24.98) v1(92.84,21.8) v1(92.84,17.61) v1(93.18,13.7) v1(93.22,11.52) v1(93.22,7.33) v1(93.18,4.43) v2(4.8,63) v2(4.8,7) v2(5.44,64.56) v2(5.44,61.44) v2(5.44,8.56) v2(5.44,5.44) v2(7,65.2) v2(7,60.8) v2(7,9.2) v2(7,4.8) v2(8,50.44) v2(8.56,64.56) v2(8.56,61.44) v2(8.56,8.56) v2(8.56,5.44) v2(9.2,63) v2(9.2,7) v2(13.72,12.41) v2(14.22,49.73) v2(14.22,48.81) v2(15.24,31.97) v2(15.43,12.6) v2(15.36,7.77) v2(16.26,44.03) v2(17.14,31.97) v2(18.29,44.98) v2(18.29,44.09) v2(18.95,13.93) v2(19.18,31.97) v2(19.58,44.98) v2(19.58,44.09) v2(21.93,33.89) v2(22.23,12.34) v2(22.61,33.89) v2(23.27,33.89) v2(23.86,47.22) v2(24.64,47.22) v2(24.67,8.05) v2(25.37,47.22) v2(27.62,41.42) v2(28.16,33.42) v2(29.84,41.36) v2(29.8,38.76) v2(29.8,37.95) v2(31.62,12.66) v2(32.96,36.73) v2(33.27,24.83) v2(33.34,12.72) v2(33.31,7.9) v2(33.36,33.11) v2(33.46,41.76) v2(33.66,25.74) v2(34.16,51.26) v2(34.15,43.33) v2(35.43,25.74) v2(36.73,13.8) v2(37.02,38.5) v2(37.02,36.73) v2(37.08,34.89) v2(37.8,41.04) v2(38.13,34.19) v2(39.5,34.14) v2(40.14,12.47) v2(40.61,60.73) v2(41.59,58.95) v2(42.02,54.19) v2(42.45,8.25) v2(43.9,1.62) v2(44.85,36.73) v2(47.06,60.73) v2(47.06,58.95) v2(48.2,56.79) v2(48.2,55.01) v2(48.2,53.24) v2(48.39,31.53) v2(49.78,12.66) v2(51.1,1.62) v2(51.3,8.15) v2(51.5,12.98) v2(52.17,60.47) v2(53.02,58.7) v2(53.45,53.81) v2(54.9,14.06) v2(55.4,46.9) v2(55.53,43.3) v2(58.3,12.72) v2(58.49,60.47) v2(58.49,58.7) v2(59.5,56.41) v2(59.5,54.63) v2(59.5,52.86) v2(60.74,8.45) v2(62.96,46.91) v2(62.96,43.33) v2(63.98,60.35) v2(64.83,58.57) v2(65.26,53.68) v2(67.82,12.79) v2(69.53,12.98) v2(69.5,8.02) v2(70.3,60.35) v2(70.3,58.57) v2(71.44,56.41) v2(71.44,54.51) v2(71.44,52.73) v2(72.93,13.93) v2(76.59,12.72) v2(78.9,8.52) v2(84.72,48.01) v2(84.94,29.63) v2(85.8,63) v2(85.8,44.61) v2(85.8,7) v2(85.86,42.9) v2(85.89,26.36) v2(86.08,24.65) v2(86.24,32.92) v2(86.31,51.35) v2(86.44,64.56) v2(86.44,61.44) v2(86.44,8.56) v2(86.44,5.44) v2(88,65.2) v2(88,60.8) v2(88,9.2) v2(88,4.8) v2(89.56,64.56) v2(89.56,61.44) v2(89.56,8.56) v2(89.56,5.44) v2(90.2,63) v2(90.2,7) v2(90.52,35.44) v2(90.57,53.82) v2(90.71,26.29) v2(90.75,44.58)
VBAT+: length 40.3
  Bottom Layer w0.254: 26.16,40.03 26.23,39.96 C8.2 31.16,39.96 U9.5 32.53,40.54 34.8,40.54 35.24,40.09 U7.1 35.6,35.21 U10.5 ; v2(35.56,35.11) 35.56,34.63 36.96,33.24 U10.3 ; v2(26.22,41.42) 29.08,44.28 29.08,51.46 29.72,52.09 32.06,52.09 R2.2 ; 19.75,42.12 19.43,42.44 19.43,43.06 U4.7
  Bottom Layer w0.381: U11.5 31.56,35.41 C13.2 31.56,36.73 U9.5
  vias: v1(28.7,28.85) v2(16,30.41) v2(16,28.66) v2(16,26.91) v2(16,25.16) v2(19.05,30.41) v2(19.05,28.66) v2(19.05,26.91) v2(19.05,25.16) v2(20.95,41.76) v2(20.95,41.13) v2(22.02,41.77) v2(22.02,41.13) v2(22.1,30.41) v2(22.1,28.66) v2(22.1,26.91) v2(22.1,25.16) v2(22.94,41.76) v2(22.94,41.13) v2(24,41.77) v2(24,41.13) v2(25.01,41.78) v2(25.01,41.15) v2(25.15,30.41) v2(25.15,28.66) v2(25.15,26.91) v2(25.15,25.16) v2(26.03,36.47) v2(26.03,35.2) v2(26.03,33.93) v2(26.03,32.66) v2(26.08,39.52) v2(26.08,38.76) v2(26.08,37.95) v2(26.8,30.38) v2(26.8,29.49) v2(26.8,28.63) v2(26.8,27.69) v2(26.8,26.88) v2(27.69,30.38) v2(27.69,29.49) v2(27.69,28.63) v2(27.7,27.69) v2(27.69,26.88) v2(28.74,30.88) v2(28.74,29.87) v2(28.74,27.84) v2(28.74,26.82)
VCC_3V3_A:
  vias: v2(66.23,58.57) v2(66.32,60.35) v2(67.56,52.85) v2(68.9,60.35) v2(68.9,58.57)
VCC_3V3_B:
  vias: v2(54.42,58.7) v2(54.51,60.47) v2(57.09,60.47) v2(57.09,58.7)
VCC_3V3_C:
  vias: v2(42.96,60.73) v2(42.99,58.95) v2(45.66,60.73) v2(45.66,58.95)
VCC_5V: length 23.5
  Top Layer w0.762: 69.98,51.08 69.98,53.57 U14.3 ; U12.3 58.05,51.2 ; U13.3 46.62,47.63 47.28,46.98 47.34,46.98 CN10.1
  Bottom Layer w0.254: R22.1 52.82,41.3 v2(48.76,41.3)
  Bottom Layer w0.381: v2(58.1,54.63) C28.2 ; v2(46.8,55.01) v2(46.8,56.79) ; v2(70.04,54.51) v2(70.04,56.41)
  vias: v2(46.8,53.24) v2(58.12,56.41) v2(58.1,52.86) v2(70.04,52.73)
VCC_7V4_A: length 25.7
  Top Layer w0.254: H2.2 85.37,57.94 v1(78.1,57.94)
  电源加厚 w0.508: v2(66.67,46.91) 67.08,46.91 v1(78.1,57.94)
  vias: v2(89.17,53.82)
VCC_7V4_B:
  vias: v2(89.12,35.44)
VCC_7V4_C:
  vias: v2(78.87,9.87)
VCC_7V4_D:
  vias: v2(60.71,9.87)
VCC_7V4_E:
  vias: v2(42.45,9.65)
VCC_7V4_F:
  vias: v2(24.64,9.49)
VCC_BAT: length 42.6
  Top Layer w0.254: v2(50.23,33.04) 49.78,33.04 49.03,33.8 U15.5 ; U18.9 83.77,50.39 83.52,50.65
  Top Layer w0.381: U28.9 21.2,14.88 21.46,15.14 ; U22.9 75.18,14.88 75.82,15.52 ; U15.7 50.03,33.24 v2(50.23,33.04) ; U26.9 38.73,14.75 39.37,15.39 ; 83.44,32.41 83.99,31.86 U20.9 ; 57.28,15.39 56.89,15 U24.9
  Top Layer w0.762: v2(77.47,19.58) 76.96,19.58 75.82,18.44 75.82,16.85 v2(76.64,16.03) ; v2(40.19,15.77) 40.13,15.77 39.37,16.53 39.37,17.8 40.89,19.33 v2(40.89,19.83) ; v2(82.97,32.97) 82.97,32.95 82.42,32.41 80.77,32.41 79.25,33.93 v2(79.25,34.19) ; v2(58.35,15.9) 57.4,16.85 57.4,18.06 v2(59.06,19.71) ; U27.1 21.72,18.11 21.72,16.15 22.26,15.61 22.41,15.61 ; C47.2 79.93,51.6 v2(79.18,52.35)
  Bottom Layer w0.762: 51.18,31.23 50.77,31.23 50.23,31.77 v2(50.23,33.04)
  vias: v2(22.41,15.64) v2(22.99,20.85) v2(22.99,19.45) v2(24.13,20.85) v2(24.1,19.45) v2(31.21,30.82) v2(31.21,29.93) v2(31.21,27.77) v2(31.21,26.89) v2(32.64,30.88) v2(32.64,30.07) v2(32.64,29.25) v2(32.64,28.43) v2(32.64,27.61) v2(32.64,26.8) v2(35.43,27.14) v2(37.21,30.38) v2(37.21,28.72) v2(37.21,27.07) v2(40.89,21.11) v2(41.28,30.38) v2(41.28,28.72) v2(41.28,27.07) v2(42.07,21.11) v2(42.07,19.83) v2(43.66,27.3) v2(44.83,28.47) v2(46,29.64) v2(46.33,24.64) v2(47.5,25.8) v2(48.16,27.61) v2(50.29,27.33) v2(50.29,25.68) v2(50.29,24.03) v2(54.36,27.33) v2(54.36,25.68) v2(54.36,24.03) v2(58.42,27.33) v2(58.42,25.68) v2(58.42,24.03) v2(59.06,21.11) v2(60.19,21.11) v2(60.17,19.71) v2(62.48,27.33) v2(62.48,25.68) v2(62.48,24.03) v2(66.55,27.33) v2(66.55,25.68) v2(66.55,24.03) v2(69.83,28.37) v2(70.61,47.39) v2(70.61,43.33) v2(70.61,39.27) v2(70.61,35.2) v2(70.61,31.14) v2(70.99,27.2) v2(72.16,26.03) v2(72.26,47.39) v2(72.26,43.33) v2(72.26,39.27) v2(72.26,35.2) v2(72.26,31.14) v2(73.91,47.39) v2(73.91,43.33) v2(73.91,39.27) v2(73.91,35.2) v2(73.91,31.14) v2(77.47,21.23) v2(77.72,53.36) v2(77.72,52.35) v2(77.72,35.33) v2(77.72,34.19) v2(78.47,21.23) v2(78.53,19.58) v2(79.18,53.36) v2(79.27,35.33) v2(82.88,51.68)
(no net):
  vias: v1(49.66,29.49)
SERVO_PWM_A: length 99.8
  电源加厚 w0.381: v2(50,5.03) 81.71,5.03 93.73,17.04 93.73,55.9 90.81,58.82 85.85,58.82 84.53,57.5 H2.1
SERVO_PWM_B: length 78.5
  电源加厚 w0.381: v2(49,5.03) 49,5.59 50.29,6.88 81.4,6.88 92.07,17.56 92.07,38.89 91.19,39.77 86.41,39.77 84.62,37.98
SERVO_PWM_C: length 35.7
  Top Layer w0.254: H4.1 78.74,6.5 48.51,6.5 48,5.99 CN6.4
SERVO_PWM_D: length 19.7
  Top Layer w0.254: CN6.3 47,6.64 47.75,7.39 62.65,7.39 62.99,7.73 62.99,9.17 D.1
SERVO_PWM_E: length 4.5
  Top Layer w0.254: H6.1 46,7.87 CN6.2
SERVO_PWM_F: length 20.8
  Top Layer w0.254: H7.1 26.92,8.91 26.92,7.39 29.29,5.03 CN6.1
V_BC+: length 38.9
  Top Layer w0.254: v2(17.59,52.79) 24.17,52.79 NTC.1
  Bottom Layer w0.254: NTC.1 25.04,52.73 34.42,52.73 35.05,52.09 35.05,49.81 34.29,49.05 34.29,45.12 R14.2 ; C10.2 16.76,47.84 16.76,51.97 v2(17.59,52.79) ; DC2.1 10.21,48.22 R4.2
  Bottom Layer w0.381: U4.1 17.91,45.87 16.51,45.87
  Bottom Layer w0.508: C10.2 16.26,47.33 C2.1
  vias: v2(13.21,45.75)
$1N8713: length 2
  Bottom Layer w0.254: U4.2 18.42,45.89 18.42,47.01 18.03,47.39 C10.1
$1N9378:
  vias: v2(8,52.86)
$1N9790: length 1.9
  Bottom Layer w0.254: 17.65,41.3 17.92,41.57 U4.10
  vias: v2(16.13,39.9) v2(16.14,39.16) v2(16.13,38.5) v2(16.95,40.72) v2(16.95,39.9) v2(16.95,39.16) v2(16.97,38.5) v2(17.75,41.57) v2(17.75,40.72) v2(17.81,39.9) v2(17.8,39.16) v2(17.77,38.5)
$1N9964: length 0.9
  Bottom Layer w0.254: U4.8 18.92,42.19
  vias: v2(20.26,39.53) v2(20.26,38.8) v2(20.26,38.05) v2(21.08,39.53) v2(21.08,38.8) v2(21.08,38.05) v2(21.93,39.53) v2(21.93,38.8) v2(21.93,38.05)
$1N10230: length 13.8
  Top Layer w0.254: NTC.2 28.17,49.83 SLM_TEMP.1
  Bottom Layer w0.254: U4.6 20.18,43.07 20.57,43.46 20.57,43.96 R12.1 21.59,49.05 22.35,49.81 24.62,49.81 NTC.2
$1N10384: length 3.1
  Bottom Layer w0.508: F1.1 24.59,43.47 R12.2
$1N10484: length 6.9
  Top Layer w0.254: v2(18.67,49.17) 15.53,49.17 LED_R.2
  Bottom Layer w0.254: v2(18.67,49.17) 18.92,48.92 U4.3
$1N10577: length 10.2
  Top Layer w0.254: LED_G.2 15.53,52.22 v2(18.8,52.22)
  Bottom Layer w0.254: v2(18.8,52.22) 19.43,51.58 19.43,45.89 U4.4
$1N10912: length 11.8
  Bottom Layer w0.254: v2(31.12,25.8) 30.48,25.8 30.1,26.19 30.1,29.36 ; 30.1,29.36 30.54,28.92 v2(31.21,28.92) ; 30.1,29.36 30.1,31.39 30.54,31.83 Q2.1 31.16,31.88 v2(31.16,33.11) 30.84,33.42 R13.1
$1N15028: length 4.9
  Top Layer w0.254: v2(32.61,44.98) OR1_B.1
  Bottom Layer w0.254: R14.1 R15.2 32.65,41.9 32.51,41.76
$1N15144: length 6.8
  Bottom Layer w0.254: U11.2 34.16,34.06 34.42,34.31 34.42,38.61 v2(33.46,39.56)
$1N15467: length 3.5
  Bottom Layer w0.254: H1.2 30.79,50.39 R2.1 R6.2
$1N15514: length 9.2
  Top Layer w0.254: OR1_A.1 33.02,47.9 H1.1
  Bottom Layer w0.254: 31.56,41.76 30.48,42.84 30.48,47.65 H1.1
$1N17856: length 7.1
  Top Layer w0.254: 33.4,34.95 34.04,34.95 35.4,33.58 v2(35.4,33.24) 36.96,33.24 C12.2 37.47,33.23 39.14,33.23 Com_o.1
  vias: v2(33.36,35.01)
$1N18572: length 2.9
  Bottom Layer w0.254: R10.1 R9.1 39.36,35.14 U10.1
$1N18575: length 7.1
  Bottom Layer w0.254: U7.2 35.66,41.93 38.35,41.93 39.5,40.79 v2(39.5,38.12)
$1N30083: length 3
  Top Layer w0.381: 49.28,35.72 49.28,36.73 49.53,36.98 51.18,36.98
  vias: v2(51.94,37.87) v2(51.94,36.73) v2(52.83,37.87) v2(52.83,36.73) v2(53.72,37.87) v2(53.73,36.73)
$1N30214: length 1.8
  Top Layer w0.254: v2(45.47,32.82) R16.2
  Bottom Layer w0.254: v2(45.47,32.82) 46.64,32.82 R18.1
$1N30218: length 1.9
  Top Layer w0.254: v2(45.47,33.98) 46.19,33.98 R19.2
  Bottom Layer w0.254: v2(45.47,33.98) R20.1
$1N30435: length 1.3
  Top Layer w0.254: R17.2 48.53,33.17 U15.4
  vias: v2(48.39,33.08)
$1N32600: length 1.9
  Top Layer w0.254: R19.1 46.86,36.71 v2(46.85,36.73)
$1N40225:
  vias: v2(65.12,43.33)
$1N40271:
  vias: v2(53.31,43.32)
$1N40739:
  vias: v2(65.16,46.91)
$1N40843: length 16.6
  Bottom Layer w0.254: R24.2 64.89,48.66 53.97,48.66 53.34,48.03 v2(53.34,47.01)
$1N46493:
  vias: v2(10.29,52.85)
$1N46536: length 1.5
  Bottom Layer w0.254: R4.1 R85.2
$3N1090:
  vias: v2(87.36,46.11)
$3N1091: length 10.1
  Top Layer w0.254: v2(89.23,42.99) 88.12,41.88 85.29,41.88 84.28,42.9 84.28,47.16 U18.3
$3N1092:
  vias: v2(89.23,44.52)
$3N1093: length 0.1
  Top Layer w0.254: v2(87.33,42.96) C50.1
$3N1094:
  vias: v2(90.75,43.03)
$3N1095:
  vias: v2(87.45,44.52)
$3N1096: length 7.7
  Top Layer w0.254: U18.7 84.77,49.62 85.04,49.88 v2(86.31,49.88) ; v2(83.77,46.33) 83.77,47.16 U18.2
  Bottom Layer w0.254: v2(86.31,49.88) 86.31,48.11 84.46,46.25 83.85,46.25 v2(83.77,46.33)
$3N1097:
  vias: v2(84.79,52.92)
$3N1098: length 0.5
  Bottom Layer w0.762: C38.1 82.95,48.36 v2(83.32,48.36)
  vias: v2(79.55,46.45)
$3N1099:
  vias: v2(86.31,52.97)
$3N1101: length 2.1
  Top Layer w0.254: R30.2 84.27,50.91 U18.8
$3N1102: length 0.6
  Top Layer w0.254: v2(82.74,49.61) 83.22,49.61 U18.10
$3N1104: length 1.6
  Top Layer w0.254: v2(85.8,46.01) 84.77,47.04 U18.4
$3N1106: length 5.7
  Top Layer w0.381: U18.6 86.59,48.71 87.33,47.98 v2(88.15,47.98) ; R26.1 89.23,47.9 F3.1
$3N1107: length 2.5
  Top Layer w0.254: U18.1 82.57,46.45 v2(81.1,46.45)
$3N2147:
  vias: v2(84.71,34.43)
$3N2148: length 1.8
  Top Layer w0.254: R40.2 84.49,32.78 U20.8
$3N2149:
  vias: v2(86.24,34.51)
$3N2153:
  vias: v2(79.63,28.33) v2(83.35,29.92)
$3N2154: length 7.3
  Top Layer w0.254: U20.2 83.99,28 v2(83.95,27.96) ; U20.7 85.37,31.57 v2(86.27,31.57)
  Bottom Layer w0.254: v2(83.95,27.96) 84.71,27.96 86.27,29.52 v2(86.27,31.57)
$3N2155: length 0.4
  Top Layer w0.254: v2(83.09,31.32) 83.35,31.32 U20.10
$3N2156: length 3
  Top Layer w0.254: R36.1 F4.1
  Top Layer w0.381: U20.6 86.11,30.33
  vias: v2(88.06,29.6)
$3N2157: length 2.5
  Top Layer w0.254: U20.1 83.03,28.33 v2(81.18,28.33)
$3N2159: length 1.4
  Top Layer w0.254: v2(85.89,27.76) 85.89,27.88 U20.4
$3N2160: length 10.1
  Top Layer w0.254: U20.3 84.49,24.5 85.22,23.77 88.9,23.77 89.2,24.07 R42.2
  vias: v2(89.16,24.78)
$3N2163:
  vias: v2(89.19,26.33)
$3N2164:
  vias: v2(87.54,24.84)
$3N2165:
  vias: v2(87.54,26.35)
$3N2166:
  vias: v2(87.53,27.82)
$3N2167:
  vias: v2(90.71,24.78)
$3N3203:
  vias: v2(78.14,14.37)
$3N3204: length 2.1
  Top Layer w0.254: U22.8 76.59,14.38 R50.2
$3N3205:
  vias: v2(78.1,12.69)
$3N3209: length 1.1
  Top Layer w0.254: v2(73.21,16.15) 73.28,16.09 U22.11
  Bottom Layer w0.254: v2(73.21,16.15) C64.1
  vias: v2(71.25,19.36)
$3N3210: length 7.4
  Top Layer w0.254: v2(75.12,12.72) 75.12,13.24 U22.7 ; v2(71.25,14.88) 72.08,14.88 U22.2
  Bottom Layer w0.254: v2(75.12,12.72) 72.77,12.72 71.25,14.25 v2(71.25,14.88)
$3N3211: length 0.7
  Top Layer w0.254: v2(74.61,16.03) 74.61,15.51 U22.10
$3N3212: length 3.4
  Top Layer w0.254: R46.1 F5.1
  Top Layer w0.381: U22.6 73.63,12.72
  vias: v2(73.15,10.8)
$3N3213: length 2.8
  Top Layer w0.254: U22.1 71.25,16.21 v2(71.25,17.81)
$3N3215: length 1.5
  Top Layer w0.254: v2(71,12.93) 71.95,13.88 U22.4
$3N3216: length 9.8
  Top Layer w0.254: U22.3 67.69,14.38 66.93,13.61 66.93,10.7 v2(67.95,9.68)
$3N3219:
  vias: v2(69.42,9.83)
$3N3220:
  vias: v2(68.01,11.33)
$3N3221:
  vias: v2(69.48,11.33)
$3N3222:
  vias: v2(71.03,11.33)
$3N3223:
  vias: v2(67.94,8.12)
$3N4259:
  vias: v2(59.81,14.25)
$3N4260: length 2
  Top Layer w0.254: R60.2 58.04,14.5 U24.8
$3N4261:
  vias: v2(59.82,12.69)
$3N4265:
  vias: v2(52.96,19.32) v2(55.18,15.9)
$3N4266: length 7.6
  Top Layer w0.254: v2(56.96,12.72) 56.96,13.49 U24.7 ; v2(53.21,15.01) 54.04,15.01 U24.2
  Bottom Layer w0.254: v2(53.21,15.01) 53.21,13.99 54.48,12.72 v2(56.96,12.72)
$3N4267: length 0.6
  Top Layer w0.254: U24.10 56.58,15.64 v2(56.58,16.03)
$3N4268: length 3.3
  Top Layer w0.254: R56.1 F6.1
  Top Layer w0.381: 55.5,12.72 55.59,12.82 55.59,14.06
  vias: v2(54.86,10.8)
$3N4269: length 2.8
  Top Layer w0.254: U24.1 52.96,16.59 v2(52.96,17.81)
$3N4271: length 1.6
  Top Layer w0.254: U24.4 53.02,12.98 v2(52.9,12.98)
$3N4272: length 10.1
  Top Layer w0.254: R62.2 48.77,10.68 48.77,13.74 49.53,14.5 U24.3
  vias: v2(49.79,9.68)
$3N4275:
  vias: v2(51.3,9.68)
$3N4276:
  vias: v2(49.85,11.33)
$3N4277:
  vias: v2(51.4,11.33)
$3N4278:
  vias: v2(52.99,11.32)
$3N4279:
  vias: v2(49.79,8.15)
$3N5315:
  vias: v2(41.69,14.12)
$3N5316: length 1.9
  Top Layer w0.254: R70.2 40.01,14.25 U26.8
$3N5317:
  vias: v2(41.65,12.47)
$3N5321:
  vias: v2(34.93,19.11) v2(36.89,15.52)
$3N5322: length 7.4
  Top Layer w0.254: v2(38.67,12.47) 38.67,13.36 U26.7 ; U26.2 35.88,14.75 v2(35.05,14.75)
  Bottom Layer w0.254: v2(35.05,14.75) 35.05,13.74 36.32,12.47 v2(38.67,12.47)
$3N5323: length 0.4
  Top Layer w0.254: U26.10 38.29,15.26 v2(38.29,15.64)
$3N5324: length 3.2
  Top Layer w0.254: R66.1 F7.1
  Top Layer w0.381: 37.34,12.6 37.43,12.69 U26.6
  vias: v2(36.75,10.63)
$3N5325: length 2.7
  Top Layer w0.254: v2(34.93,17.56) 34.93,16.21 U26.1
$3N5327: length 1.6
  Top Layer w0.254: v2(34.74,12.72) 35.76,13.75 U26.4
$3N5328: length 9.8
  Top Layer w0.254: R72.2 30.73,10.43 30.73,13.23 31.75,14.25 U26.3
  vias: v2(31.75,9.45)
$3N5331:
  vias: v2(33.28,9.42)
$3N5332:
  vias: v2(31.62,11.26)
$3N5333:
  vias: v2(33.24,11.07)
$3N5334:
  vias: v2(34.83,11.07)
$3N5335:
  vias: v2(31.76,7.9)
$3N6371:
  vias: v2(23.75,13.86)
$3N6372: length 1.9
  Top Layer w0.254: U28.8 21.72,14.38 R80.2
$3N6373:
  vias: v2(23.74,12.34)
$3N6377: length 0.5
  Top Layer w0.254: U28.11 19.3,15.71 v2(19.24,15.77)
  vias: v2(17.02,18.98)
$3N6378: length 8.2
  Top Layer w0.254: U28.2 18.1,14.88 v2(17.02,14.88) ; U28.7 20.76,13.62 v2(20.76,12.34)
  Bottom Layer w0.254: v2(17.02,14.88) 17.02,13.74 18.42,12.34 v2(20.76,12.34)
$3N6379: length 0.6
  Top Layer w0.254: U28.10 20.64,15.51 v2(20.64,15.9)
$3N6380: length 3.3
  Top Layer w0.254: R76.1 F8.1
  Top Layer w0.381: 19.43,12.72 19.65,12.95 U28.6
  vias: v2(18.8,10.42)
$3N6381: length 2.5
  Top Layer w0.254: v2(17.02,17.39) 17.02,16.47 U28.1
$3N6383: length 2.4
  Top Layer w0.254: v2(16.89,12.5) 16.89,13.61 17.14,13.87 18.09,13.87 U28.4
$3N6384: length 10.3
  Top Layer w0.254: R82.2 12.95,10.17 12.95,13.87 13.46,14.37 18.1,14.37 U28.3
  vias: v2(13.84,9.33)
$3N6387:
  vias: v2(15.36,9.29)
$3N6388:
  vias: v2(13.72,11.01)
$3N6389:
  vias: v2(15.31,10.94)
$3N6390:
  vias: v2(16.89,10.91)
$3N6391:
  vias: v2(13.81,7.77)

## Copper pours and planes (outline as drawn; the poured copper is in the pictures)
GND on Top Layer: 14.73,23.14 9.78,23.14 9.02,22.38 9.02,17.11 9.73,16.4 14.61,16.4 15.24,17.04 15.24,22.63
GND on Top Layer: 6.91,47.95 1.95,47.95 1.19,47.18 1.19,41.92 1.9,41.21 6.78,41.21 7.41,41.85 7.41,47.44
GND on Top Layer: -5.46,75.72 103.76,75.72 103.76,-5.95 -5.46,-5.95
GND on Bottom Layer: 6.91,47.95 1.95,47.95 1.19,47.18 1.19,41.92 1.9,41.21 6.78,41.21 7.41,41.85 7.41,47.44
GND on Bottom Layer: 14.73,23.14 9.78,23.14 9.02,22.38 9.02,17.11 9.73,16.4 14.61,16.4 15.24,17.04 15.24,22.63
GND on Bottom Layer: -3.17,72.79 99.31,72.79 99.31,-2.52 -3.17,-2.52
GND on GND: 0.26,69.74 94.74,69.74 94.74,0.26 0.26,0.26
GND on 电源加厚: 14.73,23.14 9.78,23.14 9.02,22.38 9.02,17.11 9.73,16.4 14.61,16.4 15.24,17.04 15.24,22.63
GND on 电源加厚: -3.94,72.41 97.54,72.41 97.54,-1.63 -3.94,-1.63
GND on 电源加厚: 6.91,47.95 1.95,47.95 1.19,47.18 1.19,41.92 1.9,41.21 6.78,41.21 7.41,41.85 7.41,47.44
VBAT+ on Top Layer: 26.54,26.06 26.03,26.57 26.03,30.76 26.67,31.39 29.16,31.39 29.67,30.88 29.67,26.52 29.21,26.06
VBAT+ on Top Layer: 20.11,41.98 20.32,42.19 26.56,42.19 26.92,41.83 26.92,37.48 26.8,37.36 25.27,37.36 25.15,37.49 25.15,40.28 24.89,40.54 20.45,40.54 20.11,40.87
VBAT+ on Bottom Layer: 26.79,26.03 29.23,26.03 30.01,26.82 30.01,30.96 29.57,31.4 27.42,31.4 26.8,32.03 26.79,32.02
VBAT+ on Bottom Layer: 19.58,42.29 26.55,42.29 26.92,41.92 26.92,26.05 25.53,24.66 9.53,24.66 9.02,25.17 9.02,30.38 9.78,31.14 24.26,31.14 25.15,32.03 25.15,40.28 24.89,40.54 19.81,40.54 19.56,40.79 19.56,42.27
VBAT+ on 电源加厚: 19.58,42.29 26.55,42.29 26.92,41.92 26.92,26.05 25.53,24.66 9.53,24.66 9.02,25.17 9.02,30.38 9.78,31.14 24.26,31.14 25.15,32.03 25.15,40.28 24.89,40.54 19.81,40.54 19.56,40.79 19.56,42.27
VBAT+ on 电源加厚: 9.02,30.38 9.78,31.14 26.16,31.14 26.92,30.38 26.92,26.06 25.4,24.53 9.65,24.53 9.02,25.17
VBAT+ on 电源加厚: 26.79,26.03 29.23,26.03 30.01,26.82 30.01,30.96 29.57,31.4 27.42,31.4 26.8,32.03 26.79,32.02
VCC_3V3_A on Top Layer: 66.32,60.35 67.56,61.59 67.56,63.4 67.82,63.65 69.6,63.65 69.85,63.4 69.85,61.05 69.15,60.35
VCC_3V3_A on Top Layer: 67.05,54.66 67.05,55.68 65.78,56.95 65.78,58.47 69.35,58.47 69.35,56.95 68.08,55.68 68.07,55.68 68.07,54.83 67.9,54.66
VCC_3V3_B on Top Layer: 54.23,60.73 55.37,61.87 55.37,63.27 55.63,63.52 57.78,63.52 58.04,63.27 58.04,61.23 57.29,60.48 54.48,60.48
VCC_3V3_B on Top Layer: 55.24,54.65 55.24,55.66 53.97,56.93 53.97,58.46 57.54,58.46 57.54,56.93 56.27,55.66 56.26,55.66 56.26,54.81 56.09,54.65
VCC_3V3_C on Top Layer: 43.31,61.11 44.2,62 44.2,63.27 44.45,63.52 46.1,63.52 46.35,63.27 46.35,61.36 45.97,60.98 43.43,60.98
VCC_3V3_C on Top Layer: 43.81,55.14 43.81,56.16 42.54,57.43 42.54,58.95 46.11,58.95 46.11,57.43 44.84,56.16 44.83,56.16 44.83,55.31 44.67,55.14
VCC_5V on Top Layer: 44.96,48.66 46.35,50.06 47.12,50.06 48.51,48.66 48.51,48.41 45.21,48.41
VCC_5V on Top Layer: 43.94,47.57 43.94,49.68 46.35,52.09 46.93,52.09 48.2,50.82 48.39,50.82 45.14,47.57
VCC_5V on Top Layer: 44.96,40.79 43.94,41.81 43.94,47.65 44.96,48.66 50.16,48.66 51.18,47.65 51.18,41.77 50.2,40.79
VCC_5V on Top Layer: 46.61,50.95 51.94,50.95 51.94,48.81 50.91,47.78 46.88,47.78 45.61,49.05 46.61,50.04
VCC_5V on Top Layer: 49.15,48.41 51.69,50.95 57.28,50.95 57.66,51.33 58.45,51.33 58.83,50.95 68.96,50.95 69.6,51.58 70.36,51.58 70.99,50.95 70.99,49.68 69.98,48.66 52.71,48.66 51.05,47.01 51.05,45.23 50.8,44.98 49.15,46.63
VCC_7V4_A on Top Layer: 87.58,51.28 87.58,53.19 85.8,54.96 85.8,57.12 86.18,57.5 87.71,57.5 88.22,57 88.22,55.09 88.47,54.84 89.02,54.84 89.62,54.23 89.62,53.18 90.12,52.68 90.88,52.68 91.11,52.34 90.5,51.28
VCC_7V4_B on Top Layer: 87.41,33.03 87.41,34.94 85.89,36.46 85.89,38.87 86.27,39.25 87.79,39.25 88.3,38.75 88.3,36.84 88.55,36.59 88.97,36.59 89.58,35.98 89.58,35.06 90.21,34.43 90.59,34.43 90.97,34.05 89.95,33.03
VCC_7V4_C on Top Layer: 76.45,11.45 78.36,11.45 79.88,12.98 82.3,12.98 82.68,12.6 82.68,11.07 82.17,10.56 80.26,10.56 80.01,10.31 80.01,10.02 79.53,9.54 78.73,9.54 77.85,8.66 77.85,8.28 77.53,7.96 76.45,9.04
VCC_7V4_D on Top Layer: 58.29,11.45 60.2,11.45 61.72,12.98 64.13,12.98 64.52,12.6 64.52,11.07 64.13,10.69 62.23,10.69 61.85,10.31 61.85,10.02 61.25,9.41 60.44,9.41 59.69,8.66 59.69,8.28 59.37,7.96 58.29,9.04
VCC_7V4_E on Top Layer: 40,11.2 41.91,11.2 43.43,12.72 45.85,12.72 46.23,12.34 46.23,10.82 45.85,10.44 43.94,10.44 43.56,10.06 43.56,9.76 42.96,9.16 42.16,9.16 41.4,8.41 41.4,8.02 41.08,7.71 40,8.79
VCC_7V4_F on Top Layer: 22.22,11.07 24,11.07 25.65,12.72 28.07,12.72 28.45,12.34 28.45,10.82 28.07,10.44 26.16,10.44 25.78,10.06 25.78,9.51 25.3,9.03 24.25,9.03 23.62,8.41 23.62,7.9 23.24,7.52 22.22,8.53
VCC_BAT on Top Layer: 82.25,50.39 81.48,51.15 81.48,51.79 81.99,52.3 83.39,52.3 83.77,51.92 83.77,50.39
VCC_BAT on Top Layer: 75.42,15.07 75.42,17.27 76.88,15.77 76.17,15.07
VCC_BAT on Top Layer: 31.06,31.27 33.15,31.27 33.53,30.88 33.53,26.82 33.15,26.44 31.15,26.44 30.77,26.82 30.77,30.97
VCC_BAT on Top Layer: 83.73,32.03 82.08,32.03 81.82,32.29 83.11,33.34 83.73,32.99
VCC_BAT on Top Layer: 21.33,14.88 21.33,16.15 21.46,16.28 22.41,15.33 21.96,14.88
VCC_BAT on Top Layer: 57.04,15.29 57.04,16.94 57.3,17.2 58.5,16 57.8,15.29
VCC_BAT on Top Layer: 39.02,15.07 39.02,16.72 39.09,16.79 40.22,15.65 39.64,15.07
VCC_BAT on Bottom Layer: 56.9,23.77 58.42,22.25 58.42,19.2 58.8,18.82 60.45,18.82 60.83,19.2 60.83,22.25 62.36,23.77
VCC_BAT on Bottom Layer: 22.73,18.44 22.35,18.82 22.35,22.12 23.88,23.64 37.34,23.64 38.1,24.41 38.1,25.55 36.83,26.82 41.66,26.82 40.64,25.63 40.64,24.03 42.67,21.99 42.67,19.2 42.16,18.69 40.77,18.69 40.26,19.2 40.26,20.6 39.62,21.23 25.4,21.23 24.77,20.6 24.77,18.82 24.38,18.44
VCC_BAT on Bottom Layer: 66.71,43.69 69.32,43.69 69.85,44.22 69.85,42.46 69.34,42.95 66.71,42.95
VCC_BAT on Bottom Layer: 31.06,31.27 33.15,31.27 33.53,30.88 33.53,26.82 33.15,26.44 31.15,26.44 30.77,26.82 30.77,30.97
VCC_BAT on Bottom Layer: 74.17,38 76.2,35.96 79.88,35.96 80.14,35.71 80.14,33.81 79.88,33.55 76.2,33.55 74.29,31.77 74.17,31.77
VCC_BAT on Bottom Layer: 70.68,49.24 75.56,54.12 79.63,54.12 80.01,53.74 80.01,52.09 79.63,51.71 78.23,51.71 74.68,48.16 71.75,48.16
VCC_BAT on Bottom Layer: 33.02,31.14 46.23,31.14 49.15,28.22 67.82,28.22 69.72,30.12 69.72,48.28 70.87,49.43 73.53,49.43 74.68,48.28 74.68,27.07 70.87,23.26 45.97,23.26 42.8,26.44 32.13,26.44 31.88,26.69 31.88,30
VCC_BAT on Bottom Layer: 51.31,31.39 54.37,31.39 54.37,28.96 55.25,28.09 50.42,28.09 51.31,28.98
VCC_BAT on Bottom Layer: 70.61,23.26 75.56,23.26 76.71,22.12 76.71,19.2 77.09,18.82 78.74,18.82 79.12,19.2 79.12,22.63 74.55,27.2
VCC_BAT on 电源加厚: 33.15,31.14 46.35,31.14 49.28,28.22 67.94,28.22 69.85,30.12 69.85,48.28 70.99,49.43 73.66,49.43 74.8,48.28 74.8,27.07 70.99,23.26 46.1,23.26 42.93,26.44 32.26,26.44 32,26.69 32,30
VCC_BAT on 电源加厚: 31.06,31.27 33.15,31.27 33.53,30.88 33.53,26.82 33.15,26.44 31.15,26.44 30.77,26.82 30.77,30.97
V_BC+ on Bottom Layer: 8.76,46.12 9.4,46.76 16.89,46.76 17.27,46.38 17.27,44.97 17.03,44.73 12.45,44.73 12.06,44.35 12.06,42.44 11.3,41.68 9.4,41.68 8.76,42.31
$1N9790 on Bottom Layer: 15.37,40.03 17.81,42.47 18.05,42.47 18.29,42.23 18.29,38.25 17.91,37.87 15.75,37.87 15.37,38.25
$1N9790 on 电源加厚: 15.37,40.03 17.81,42.47 18.05,42.47 18.29,42.23 18.29,38.25 17.91,37.87 15.75,37.87 15.37,38.25
$1N9922 on Top Layer: 22.76,39.04 22.86,39.14 24.64,39.14 24.77,39.01 24.77,35.45 24.71,35.39 23.43,35.39 23.24,35.58 23.24,37.49 22.76,37.97
$1N9964 on Top Layer: 19.81,39.97 20,40.16 22.1,40.16 22.35,39.9 22.35,37.49 21.97,37.11 21.97,35.58 21.72,35.33 20.19,35.33 19.81,35.71
$1N9964 on Top Layer: 19.81,39.97 20,40.16 22.1,40.16 22.35,39.9 22.35,37.49 21.97,37.11 21.97,35.58 21.72,35.33 20.19,35.33 19.81,35.71
$1N9964 on Bottom Layer: 18.92,42.52 18.67,42.27 18.67,38.89 19.94,37.61 21.97,37.61 22.35,38 22.35,39.9 22.1,40.16 19.69,40.16 19.18,40.66 19.18,42.27
$1N10479 on Top Layer: 12.32,52.51 12.45,52.73 13.72,52.73 13.84,52.6 13.84,46.89 13.72,46.76 12.63,46.76 12.32,47.07
$1N30083 on Top Layer: 50.77,38.63 54.23,38.63 54.48,38.38 54.48,36.47 54.23,36.22 50.72,36.22 50.22,36.98
$1N32600 on Top Layer: 47.29,34.36 48.13,35.2 48.77,35.2 48.9,35.33 48.9,37.23 49.02,37.36 49.82,37.36 50.09,37.63 50.09,38.96 49.78,39.27 46.61,39.27 45.97,38.63 45.97,34.69 46.31,34.36
$3N1098 on Top Layer: 82.84,47.81 80.37,47.81 80.04,47.48 76.86,47.48 76.86,48.5 77.25,48.88 83.11,48.88 83.11,48.08
$3N1106 on Top Layer: 87.71,47.33 87.69,47.34 86.93,47.34 85.71,48.56 85.71,48.71 85.73,48.71 85.88,48.86 91.12,48.86 91.13,47.33
$3N2153 on Top Layer: 82.99,29.5 80.39,29.5 80.06,29.17 76.89,29.17 76.89,30.31 77.14,30.57 83.13,30.57 83.13,29.64
